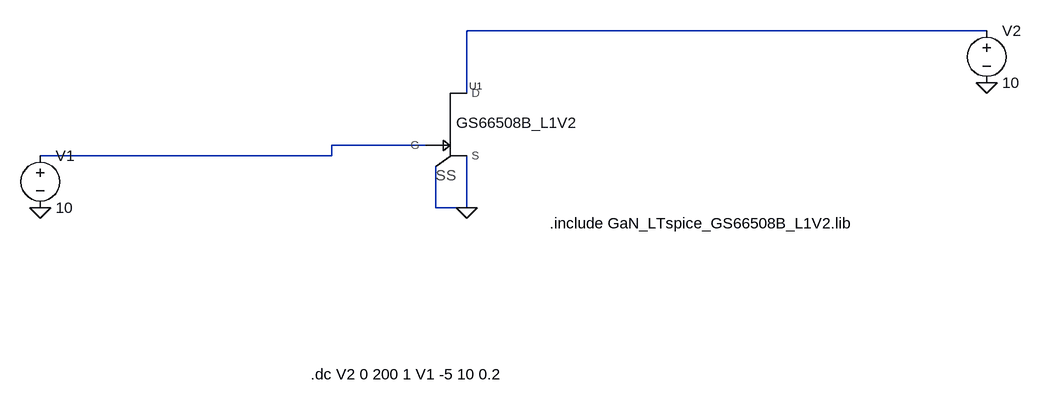
[diagram p0: schematic Id-Vds.asc]
Id-Vds.asc, the LTspice schematic file:
Version 4
SHEET 1 1032 680
WIRE 976 -80 176 -80
WIRE 176 16 176 -80
WIRE 112 96 -32 96
WIRE -32 112 -32 96
WIRE -32 112 -480 112
WIRE 128 192 128 128
WIRE 176 192 176 112
WIRE 176 192 128 192
FLAG 976 0 0
FLAG -480 192 0
FLAG 176 192 0
SYMBOL GaN_E-HEMT_LT_GS66508B_L1V2 128 64 R0
SYMATTR InstName U1
SYMBOL voltage -480 96 R0
WINDOW 123 0 0 Left 2
WINDOW 39 0 0 Left 2
SYMATTR InstName V1
SYMATTR Value 10
SYMBOL voltage 976 -96 R0
WINDOW 123 0 0 Left 2
WINDOW 39 0 0 Left 2
SYMATTR InstName V2
SYMATTR Value 10
TEXT 304 216 Left 2 !.include GaN_LTspice_GS66508B_L1V2.lib
TEXT -64 448 Left 2 !.dc V2 0 200 1 V1 -5 10 0.2

The netlist it stands for:
* Id-Vds.asc
XU1 N002 N001 0 0 GS66508B_L1V2  ; pins G D S SS
V1 N002 0 10
V2 N001 0 10
.include GaN_LTspice_GS66508B_L1V2.lib
.dc V2 0 200 1 V1 -5 10 0.2
.lib GaN_LTspice_GS66508B_L1V2.lib
.backanno
.end